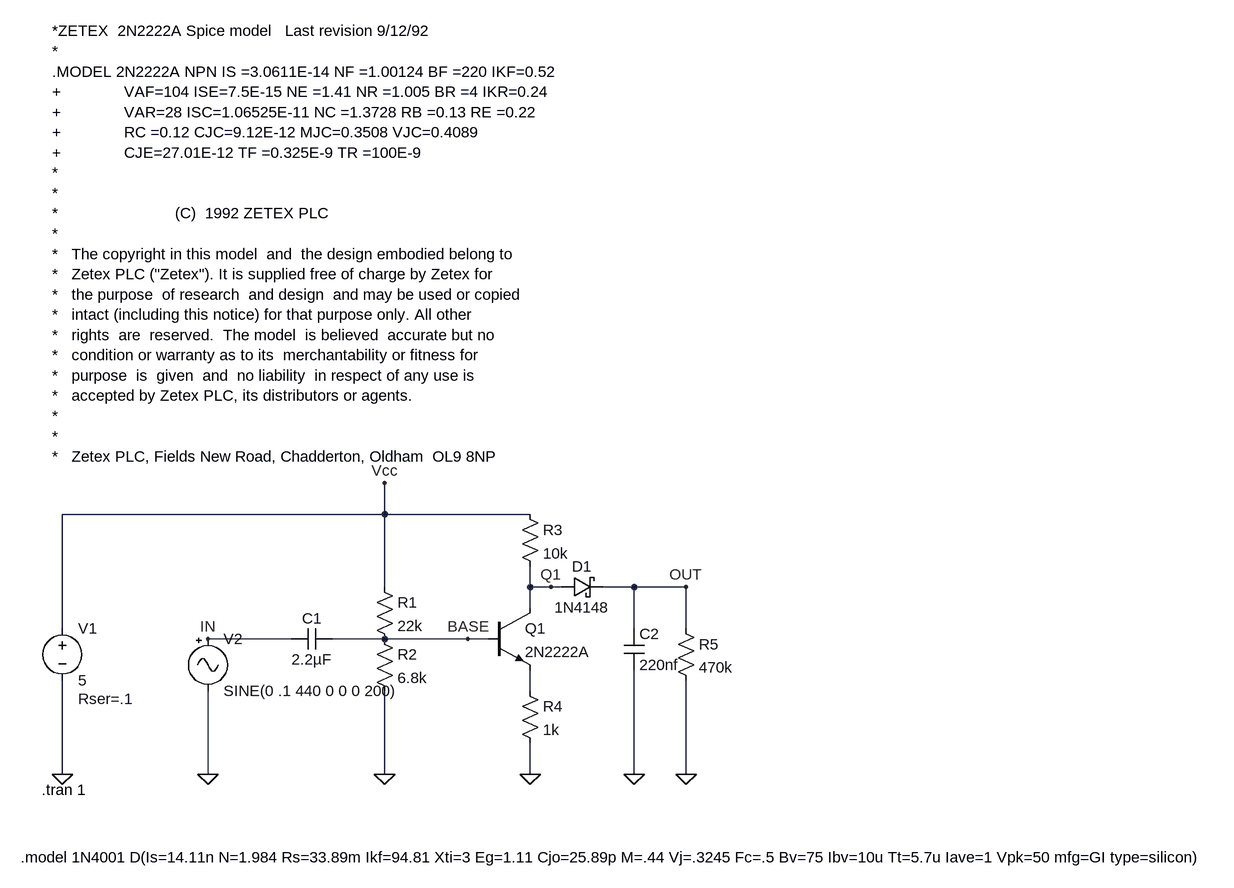
[diagram p0: schematic DuinoVox.asc]
DuinoVox.asc, the LTspice schematic file:
Version 4
SHEET 1 1328 680
WIRE 32 -80 32 -128
WIRE 32 -80 -464 -80
WIRE 256 -80 32 -80
WIRE 32 32 32 -80
WIRE 256 32 256 0
WIRE 288 32 256 32
WIRE 304 32 288 32
WIRE 416 32 368 32
WIRE 496 32 416 32
WIRE 256 64 256 32
WIRE -464 96 -464 -80
WIRE 416 96 416 32
WIRE 496 96 496 32
WIRE -112 112 -240 112
WIRE 32 112 -48 112
WIRE 160 112 32 112
WIRE 192 112 160 112
WIRE 256 192 256 160
WIRE -464 320 -464 176
WIRE -240 320 -240 192
WIRE 32 320 32 192
WIRE 256 320 256 272
WIRE 416 320 416 160
WIRE 496 320 496 176
FLAG 32 320 0
FLAG 32 -128 Vcc
FLAG 256 320 0
FLAG 416 320 0
FLAG 496 320 0
FLAG -464 320 0
FLAG -240 320 0
FLAG -240 112 IN
FLAG 496 32 OUT
FLAG 160 112 BASE
FLAG 288 32 Q1
SYMBOL cap -48 96 R90
WINDOW 0 0 32 VBottom 2
WINDOW 3 32 32 VTop 2
SYMATTR InstName C1
SYMATTR Value 2.2µF
SYMBOL res 16 16 R0
SYMATTR InstName R1
SYMATTR Value 22k
SYMBOL res 16 96 R0
SYMATTR InstName R2
SYMATTR Value 6.8k
SYMBOL schottky 304 48 R270
WINDOW 0 32 32 VTop 2
WINDOW 3 0 32 VBottom 2
SYMATTR InstName D1
SYMATTR Value 1N4148
SYMATTR Description Diode
SYMATTR Type diode
SYMBOL npn 192 64 R0
SYMATTR InstName Q1
SYMATTR Value 2N2222A
SYMBOL res 240 -96 R0
SYMATTR InstName R3
SYMATTR Value 10k
SYMBOL res 240 176 R0
SYMATTR InstName R4
SYMATTR Value 1k
SYMBOL cap 400 96 R0
SYMATTR InstName C2
SYMATTR Value 220nf
SYMBOL res 480 80 R0
SYMATTR InstName R5
SYMATTR Value 470k
SYMBOL voltage -464 80 R0
WINDOW 123 0 0 Left 2
WINDOW 39 24 124 Left 2
SYMATTR SpiceLine Rser=.1
SYMATTR InstName V1
SYMATTR Value 5
SYMBOL Misc\\signal -240 96 R0
WINDOW 123 0 0 Left 2
WINDOW 39 0 0 Left 2
SYMATTR InstName V2
SYMATTR Value SINE(0 .1 440 0 0 0 200)
TEXT -496 344 Left 2 !.tran 1
TEXT -528 448 Left 2 !.model 1N4001 D(Is=14.11n N=1.984 Rs=33.89m Ikf=94.81 Xti=3 Eg=1.11 Cjo=25.89p M=.44 Vj=.3245 Fc=.5 Bv=75 Ibv=10u Tt=5.7u Iave=1 Vpk=50 mfg=GI type=silicon)
TEXT -480 -824 Left 2 !*ZETEX  2N2222A Spice model   Last revision 9/12/92\n*\n.MODEL 2N2222A NPN IS =3.0611E-14 NF =1.00124 BF =220 IKF=0.52 \n+              VAF=104 ISE=7.5E-15 NE =1.41 NR =1.005 BR =4 IKR=0.24 \n+              VAR=28 ISC=1.06525E-11 NC =1.3728 RB =0.13 RE =0.22 \n+              RC =0.12 CJC=9.12E-12 MJC=0.3508 VJC=0.4089 \n+              CJE=27.01E-12 TF =0.325E-9 TR =100E-9\n*\n*\n*                          (C)  1992 ZETEX PLC\n*\n*   The copyright in this model  and  the design embodied belong to\n*   Zetex PLC ("Zetex"). It is supplied free of charge by Zetex for\n*   the purpose  of research  and design  and may be used or copied\n*   intact (including this notice) for that purpose only. All other\n*   rights  are  reserved.  The model  is believed  accurate but no\n*   condition or warranty as to its  merchantability or fitness for\n*   purpose  is  given  and  no liability  in respect of any use is\n*   accepted by Zetex PLC, its distributors or agents.\n*\n*\n*   Zetex PLC, Fields New Road, Chadderton, Oldham  OL9 8NP

The netlist it stands for:
* DuinoVox.asc
C1 BASE IN 2.2µF
R1 Vcc BASE 22k
R2 BASE 0 6.8k
D1 Q1 OUT 1N4148
Q1 Q1 BASE N001 0 2N2222A
R3 Vcc Q1 10k
R4 N001 0 1k
C2 OUT 0 220nf
R5 OUT 0 470k
V1 Vcc 0 5 Rser=.1
V2 IN 0 SINE(0 .1 440 0 0 0 200)
.model D D
.lib standard.dio
.model NPN NPN
.model PNP PNP
.lib standard.bjt
.tran 1
.model 1N4001 D(Is=14.11n N=1.984 Rs=33.89m Ikf=94.81 Xti=3 Eg=1.11 Cjo=25.89p M=.44 Vj=.3245 Fc=.5 Bv=75 Ibv=10u Tt=5.7u Iave=1 Vpk=50 mfg=GI type=silicon)
*ZETEX  2N2222A Spice model   Last revision 9/12/92
*
.MODEL 2N2222A NPN IS =3.0611E-14 NF =1.00124 BF =220 IKF=0.52
+              VAF=104 ISE=7.5E-15 NE =1.41 NR =1.005 BR =4 IKR=0.24
+              VAR=28 ISC=1.06525E-11 NC =1.3728 RB =0.13 RE =0.22
+              RC =0.12 CJC=9.12E-12 MJC=0.3508 VJC=0.4089
+              CJE=27.01E-12 TF =0.325E-9 TR =100E-9
*
*
*                          (C)  1992 ZETEX PLC
*
*   The copyright in this model  and  the design embodied belong to
*   Zetex PLC ("Zetex"). It is supplied free of charge by Zetex for
*   the purpose  of research  and design  and may be used or copied
*   intact (including this notice) for that purpose only. All other
*   rights  are  reserved.  The model  is believed  accurate but no
*   condition or warranty as to its  merchantability or fitness for
*   purpose  is  given  and  no liability  in respect of any use is
*   accepted by Zetex PLC, its distributors or agents.
*
*
*   Zetex PLC, Fields New Road, Chadderton, Oldham  OL9 8NP
.backanno
.end